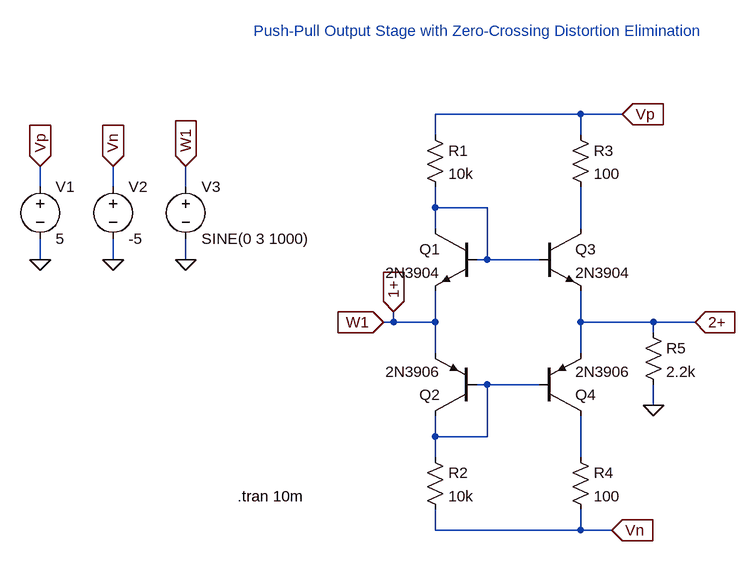
[diagram p0: schematic pp_out_stage_zero_cross_elim_ltspice.asc]
pp_out_stage_zero_cross_elim_ltspice.asc, the LTspice schematic file:
Version 4
SHEET 1 880 680
WIRE 304 -112 80 -112
WIRE 368 -112 304 -112
WIRE 80 -80 80 -112
WIRE 304 -80 304 -112
WIRE -528 0 -528 -32
WIRE -416 0 -416 -32
WIRE -304 0 -304 -32
WIRE 80 32 80 0
WIRE 160 32 80 32
WIRE 80 64 80 32
WIRE 304 64 304 0
WIRE -528 112 -528 80
WIRE -416 112 -416 80
WIRE -304 112 -304 80
WIRE 160 112 160 32
WIRE 160 112 144 112
WIRE 240 112 160 112
WIRE 16 208 16 192
WIRE 16 208 0 208
WIRE 80 208 80 160
WIRE 80 208 16 208
WIRE 304 208 304 160
WIRE 416 208 304 208
WIRE 480 208 416 208
WIRE 416 224 416 208
WIRE 80 256 80 208
WIRE 304 256 304 208
WIRE 160 304 144 304
WIRE 240 304 160 304
WIRE 416 336 416 304
WIRE 80 384 80 352
WIRE 160 384 160 304
WIRE 160 384 80 384
WIRE 80 416 80 384
WIRE 304 416 304 352
WIRE 80 528 80 496
WIRE 304 528 304 496
WIRE 304 528 80 528
WIRE 352 528 304 528
FLAG 416 336 0
FLAG 368 -112 Vp
IOPIN 368 -112 In
FLAG 480 208 2+
IOPIN 480 208 In
FLAG 352 528 Vn
IOPIN 352 528 In
FLAG 0 208 W1
IOPIN 0 208 In
FLAG 16 192 1+
IOPIN 16 192 In
FLAG -528 112 0
FLAG -416 112 0
FLAG -304 112 0
FLAG -528 -32 Vp
IOPIN -528 -32 In
FLAG -416 -32 Vn
IOPIN -416 -32 In
FLAG -304 -32 W1
IOPIN -304 -32 In
SYMBOL npn 144 64 M0
SYMATTR InstName Q1
SYMATTR Value 2N3904
SYMBOL pnp 144 352 R180
SYMATTR InstName Q2
SYMATTR Value 2N3906
SYMBOL npn 240 64 R0
SYMATTR InstName Q3
SYMATTR Value 2N3904
SYMBOL pnp 240 352 M180
SYMATTR InstName Q4
SYMATTR Value 2N3906
SYMBOL res 64 -96 R0
SYMATTR InstName R1
SYMATTR Value 10k
SYMBOL res 64 400 R0
SYMATTR InstName R2
SYMATTR Value 10k
SYMBOL res 288 -96 R0
SYMATTR InstName R3
SYMATTR Value 100
SYMBOL res 288 400 R0
SYMATTR InstName R4
SYMATTR Value 100
SYMBOL res 400 208 R0
SYMATTR InstName R5
SYMATTR Value 2.2k
SYMBOL voltage -528 -16 R0
WINDOW 123 0 0 Left 0
WINDOW 39 0 0 Left 0
SYMATTR InstName V1
SYMATTR Value 5
SYMBOL voltage -416 -16 R0
WINDOW 123 0 0 Left 0
WINDOW 39 0 0 Left 0
SYMATTR InstName V2
SYMATTR Value -5
SYMBOL voltage -304 -16 R0
WINDOW 123 0 0 Left 0
WINDOW 39 0 0 Left 0
SYMATTR InstName V3
SYMATTR Value SINE(0 3 1000)
TEXT -200 -240 Left 2 ;Push-Pull Output Stage with Zero-Crossing Distortion Elimination
TEXT -224 476 Left 2 !.tran 10m

The netlist it stands for:
* pp_out_stage_zero_cross_elim_ltspice.asc
Q1 N001 N001 1+ 0 2N3904
Q2 N003 N003 1+ 0 2N3906
Q3 N002 N001 2+ 0 2N3904
Q4 N004 N003 2+ 0 2N3906
R1 Vp N001 10k
R2 N003 Vn 10k
R3 Vp N002 100
R4 N004 Vn 100
R5 2+ 0 2.2k
V1 Vp 0 5
V2 Vn 0 -5
V3 1+ 0 SINE(0 3 1000)
.model NPN NPN
.model PNP PNP
.lib standard.bjt
* Push-Pull Output Stage with Zero-Crossing Distortion Elimination
.tran 10m
.backanno
.end